# EasyEDA Pro project MIPI-toBTB-40-pin-AMOLED-HAT.eprj

# Schematic 5.5" OLED to RP5 MIPI HAT
Board Name: 5.5" OLED to RP5 MIPI HAT; Create Date: 2026-02-24; Page Name: Sheet_V3; Project Name: MIPI-toBTB-40-pin-AMOLED-HAT; Schematic Name: 5.5" OLED to RP5 MIPI HAT; Update Date: 2026-03-05; Add into BOM: yes; Convert to PCB: yes; Date: 2025-08-22; Draw By: Hjalte Hansen; REV: 3.0; Sheet: 1/1; spicePre: .
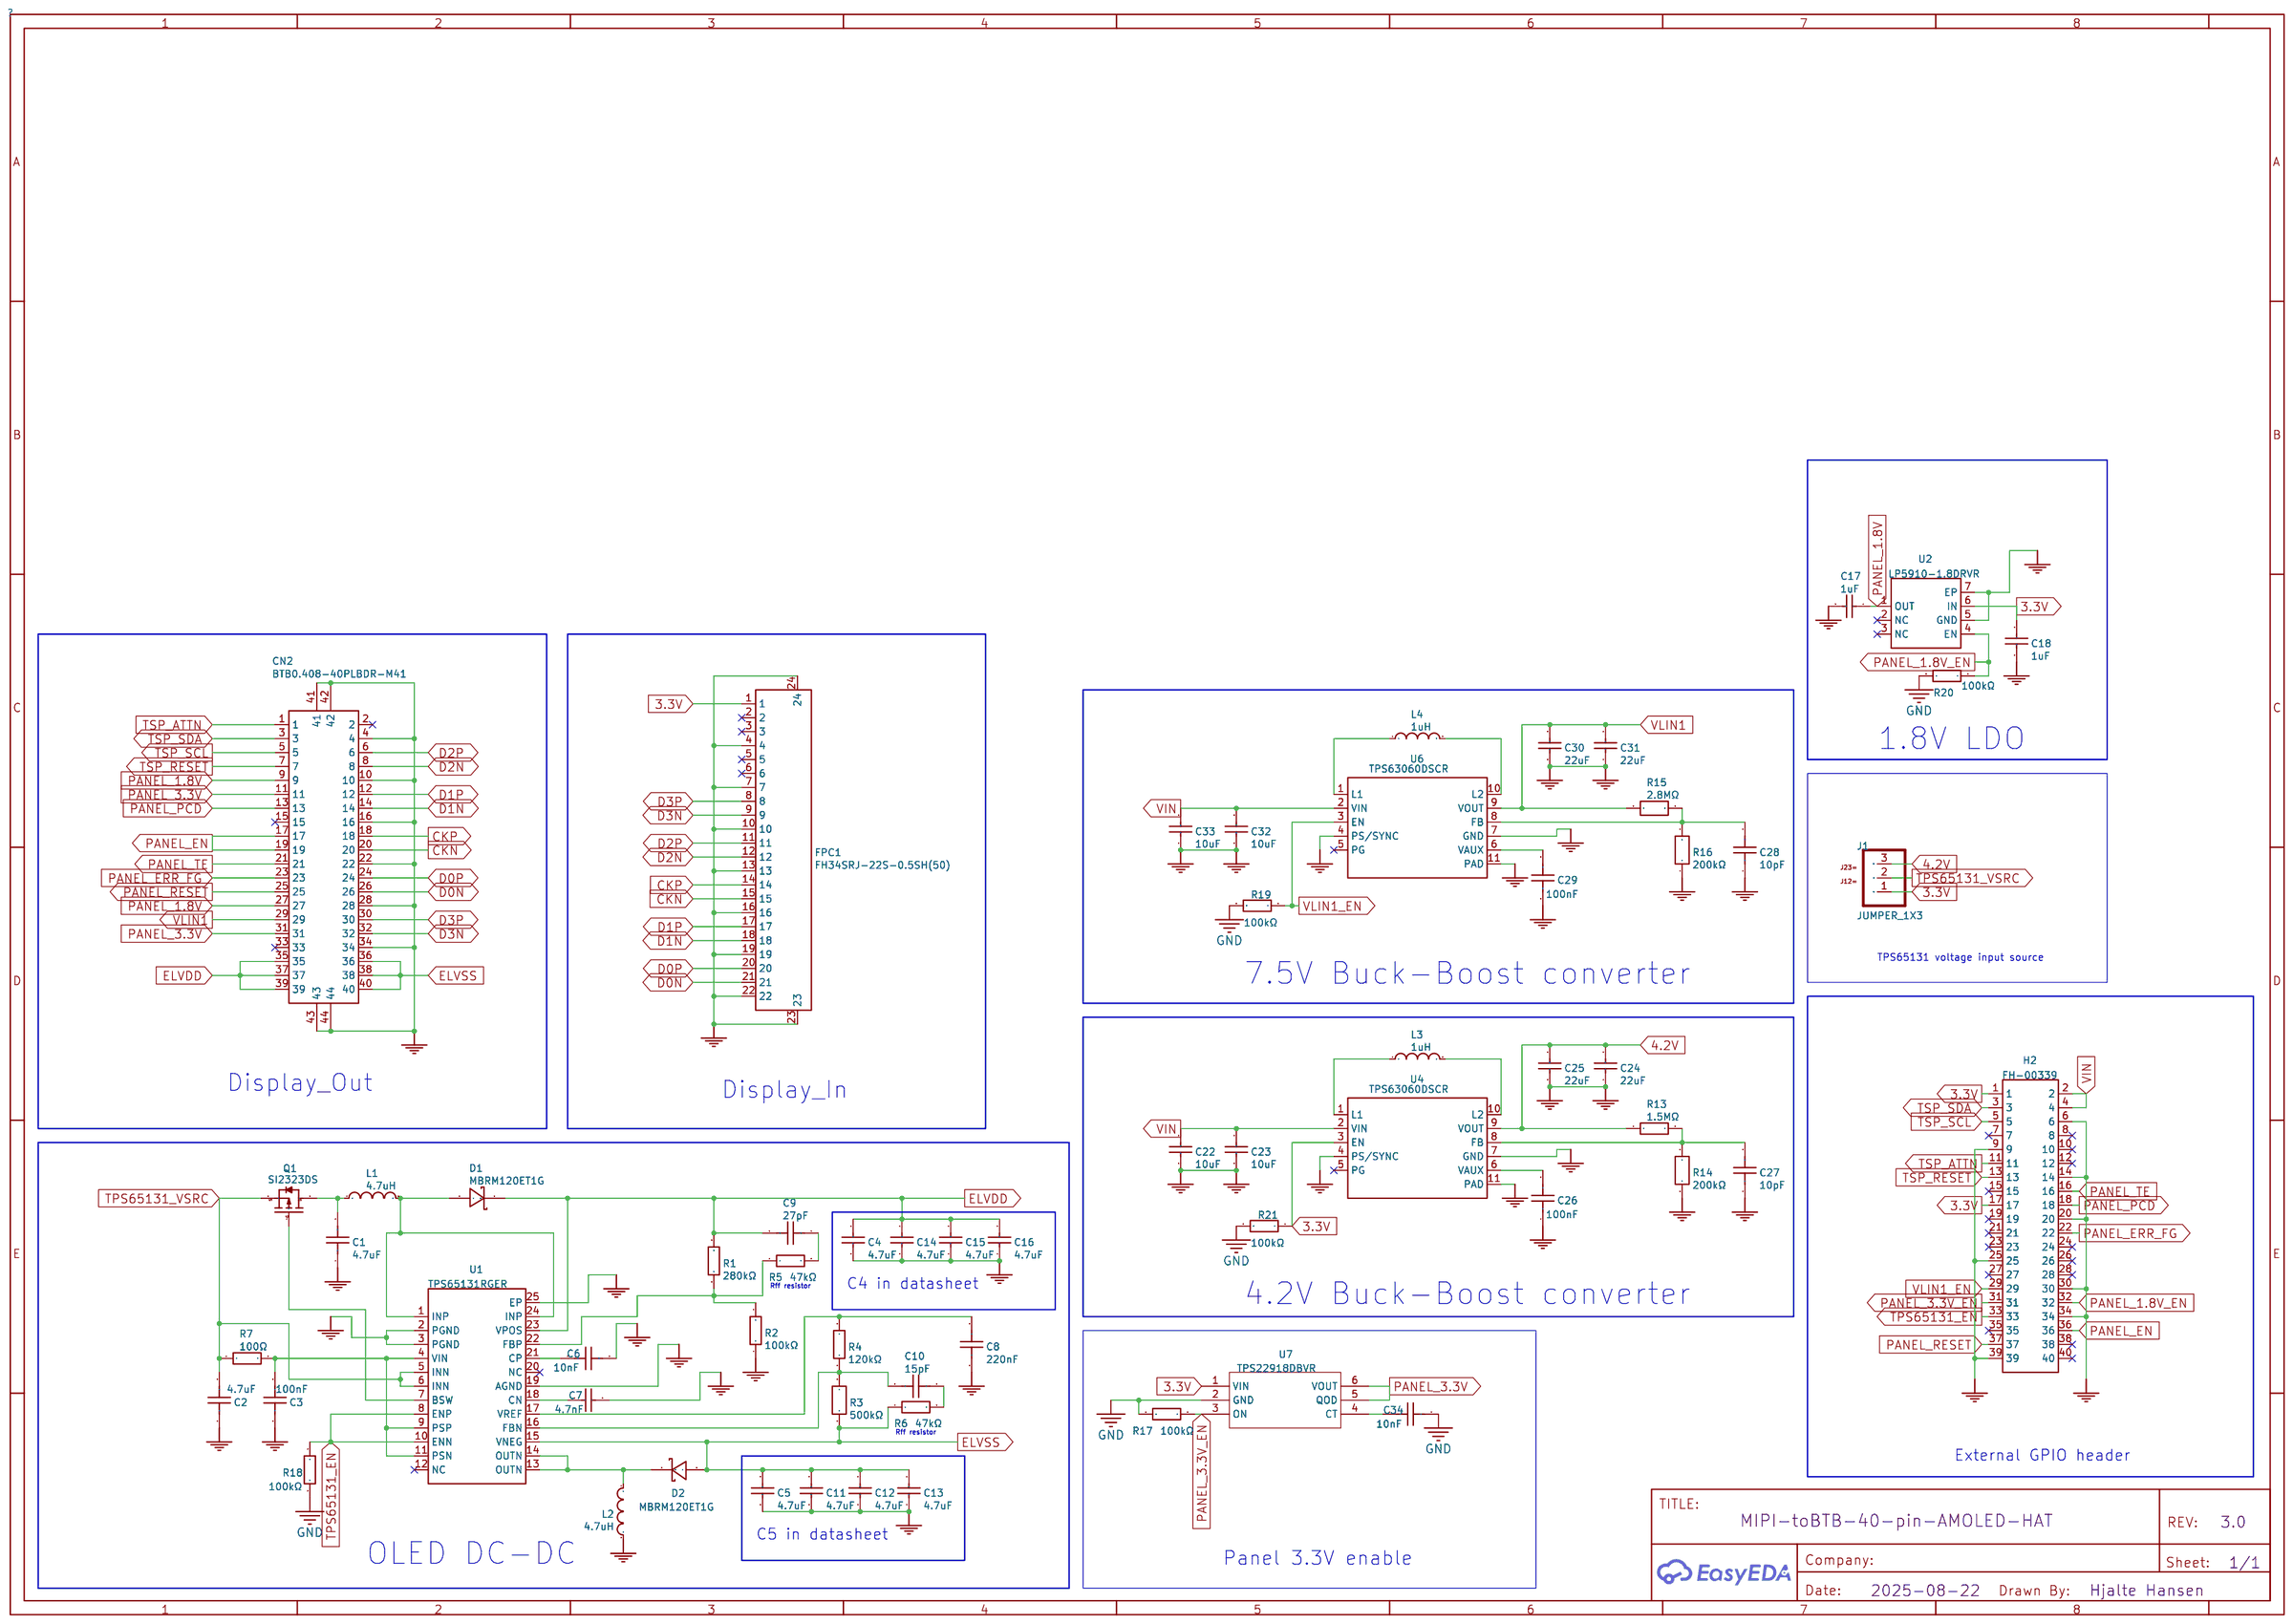
[diagram p0: schematic sheet]

## Parts
C1  4.7uF  [C0402]
C2  4.7uF  [C0402]
C3  100nF  [C0402]
C4  4.7uF  [C0805]
C5  4.7uF  [C0805]
C6  10nF  [C0402]
C7  4.7nF  [C0603]
C8  220nF  [C0402]
C9  27pF  [C0603]
C10  15pF  [C0402]
C11  4.7uF  [C0805]
C12  4.7uF  [C0805]
C13  4.7uF  [C0805]
C14  4.7uF  [C0805]
C15  4.7uF  [C0805]
C16  4.7uF  [C0805]
C17  1uF  [C0603]
C18  1uF  [C0603]
C22  10uF  [C0805]
C23  10uF  [C0805]
C24  22uF  [C0805]
C25  22uF  [C0805]
C26  100nF  [C0402]
C27  10pF  [C0402]
C28  10pF  [C0402]
C29  100nF  [C0402]
C30  22uF  [C0805]
C31  22uF  [C0805]
C32  10uF  [C0805]
C33  10uF  [C0805]
C34  10nF  [C0402]
CN2  BTB0.408-40PLBDR-M41  [CONN-SMD_40P-BTB0.408-40PLBDR-M41]
D1  MBRM120ET1G  [POWERMITE_L2.0-W1.9-LS3.8-RD]
D2  MBRM120ET1G  [POWERMITE_L2.0-W1.9-LS3.8-RD]
FPC1  FH34SRJ-22S-0.5SH(50)  [FFC-SMD_22P-P0.50_HRS_FH34SRJ-22S-0.5SH]
H2  FH-00339  [HDR-SMD_40P-P2.54-V-F-R2-C20-S6.6_FH-00339]
J1  JUMPER_1X3  [JUMPER_SOLDER]
L1  4.7uH  [IND-SMD_L4.0-W4.0_FNR40XXS]
L2  4.7uH  [IND-SMD_L4.0-W4.0_FNR40XXS]
L3  1uH  [IND-SMD_L4.5-W4.1_GSSM0420]
L4  1uH  [IND-SMD_L4.5-W4.1_GSSM0420]
Q1  SI2323DS  [SOT-23-3_L2.9-W1.3-P1.90-LS2.4-BR]
R1  280kΩ  [R0603]
R2  100kΩ  [R0603]
R3  500kΩ  [R0603]
R4  120kΩ  [R0603]
R5  47kΩ  [R0603]
R6  47kΩ  [R0603]
R7  100Ω  [R0402]
R13  1.5MΩ  [R0603]
R14  200kΩ  [R0805]
R15  2.8MΩ  [R0603]
R16  200kΩ  [R0805]
R17  100kΩ  [R0603]
R18  100kΩ  [R0603]
R19  100kΩ  [R0603]
R20  100kΩ  [R0603]
R21  100kΩ  [R0603]
U1  TPS65131RGER  [QFN-24_L4.0-W4.0-P0.50-TL-EP2.6]
U2  LP5910-1.8DRVR  [WSON-6_L2.0-W2.0-P0.65-TL-EP]
U4  TPS63060DSCR  [WSON-10_L3.0-W3.0-P0.50-BL-EP-A]
U6  TPS63060DSCR  [WSON-10_L3.0-W3.0-P0.50-BL-EP-A]
U7  TPS22918DBVR  [SOT-23-6_L2.9-W1.6-P0.95-LS2.8-BR]

## Library data of the parts
C1 C2 = 4.7uF: Supplier: LCSC; Supplier Part: C307423; Manufacturer: SAMSUNG(三星); Manufacturer Part: CL05A475MQ5NRNC; JLCPCB Part Class: Extended Part; nameAlias: Value; Contributor: LCSC; spicePre: C; spiceSymbolName: CL05A475MQ5NRNC_C307423; Package Display: No
C3 C26 C29 = 100nF: Supplier: LCSC; Supplier Part: C133086; Manufacturer: SAMSUNG(三星); Manufacturer Part: CL05B104KP5NNNC; JLCPCB Part Class: Extended Part; nameAlias: Value; Contributor: LCSC; spicePre: C; spiceSymbolName: CL05B104KP5NNNC; Package Display: No
C4 C5 C11-C13 = 4.7uF: Supplier: LCSC; Manufacturer Part: CL21A475KAQNNNE; Manufacturer: SAMSUNG(三星); Supplier Part: C1779; JLCPCB Part Class: Basic Part; nameAlias: Value; spicePre: C; spiceSymbolName: CL21A475KAQNNNE
C6 C34 = 10nF: Supplier: LCSC; Supplier Part: C318577; Manufacturer: SAMSUNG(三星); Manufacturer Part: CL05B103KO5NNNC; JLCPCB Part Class: Extended Part; nameAlias: Value; Contributor: LCSC; spicePre: C; spiceSymbolName: CL05B103KO5NNNC; Package Display: No
C7 = 4.7nF: Supplier: LCSC; Manufacturer Part: CL10B472KB8NNNC; Manufacturer: SAMSUNG(三星); Supplier Part: C1621; JLCPCB Part Class: Extended Part; nameAlias: Value; spicePre: C; spiceSymbolName: CL10B472KB8NNNC; Package Display: No
C8 = 220nF: Supplier: LCSC; Supplier Part: C307417; Manufacturer: SAMSUNG(三星); Manufacturer Part: CL05A224KQ5NNNC; JLCPCB Part Class: Extended Part; nameAlias: Value; Contributor: LCSC; spicePre: C; spiceSymbolName: CL05A224KQ5NNNC; Package Display: No
C9 = 27pF: Supplier: LCSC; Supplier Part: C2187529; Manufacturer: YAGEO(国巨); Manufacturer Part: CC0603JRNPO7BN270; JLCPCB Part Class: Extended Part; nameAlias: Value; Contributor: lcsc; spicePre: C; spiceSymbolName: CC0603JRNPO7BN270; Package Display: No
C10 = 15pF: Supplier: LCSC; Supplier Part: C1852854; Manufacturer: YAGEO(国巨); Manufacturer Part: CC0402KRNPO7BN150; JLCPCB Part Class: Extended Part; nameAlias: Value; Contributor: lcsc; spicePre: C; spiceSymbolName: CC0402KRNPO7BN150; Package Display: No
C14-C16 = 4.7uF: Supplier: LCSC; Manufacturer Part: CL21A475KAQNNNE; Manufacturer: SAMSUNG(三星); Supplier Part: C1779; JLCPCB Part Class: Basic Part; nameAlias: Value; spicePre: C; spiceSymbolName: CL21A475KAQNNNE; Package Display: No
C17 C18 = 1uF: Supplier: LCSC; Manufacturer Part: CL10A105KO8NNNC; Manufacturer: SAMSUNG(三星); Supplier Part: C1592; JLCPCB Part Class: Extended Part; nameAlias: Value; spicePre: C; spiceSymbolName: CL10A105KO8NNNC
C22 C23 C32 C33 = 10uF: Supplier: LCSC; Manufacturer Part: CL21A106KOQNNNE; Manufacturer: SAMSUNG(三星); Supplier Part: C1713; JLCPCB Part Class: Extended Part; nameAlias: Value; spicePre: C; spiceSymbolName: CL21A106KOQNNNE
C24 C25 C30 C31 = 22uF: Supplier: LCSC; Manufacturer: SAMSUNG(三星); Manufacturer Part: CL21A226MOQNNNE; Supplier Part: C98190; JLCPCB Part Class: Extended Part; nameAlias: Value; spicePre: C; spiceSymbolName: CL21A226MOQNNNE
C27 C28 = 10pF: Supplier: LCSC; Manufacturer: SAMSUNG(三星); Manufacturer Part: CL05C100JB5NNNC; Supplier Part: C32949; JLCPCB Part Class: Basic Part; nameAlias: Value; spicePre: C; spiceSymbolName: CL05C100JB5NNNC
CN2 = BTB0.408-40PLBDR-M41: Supplier: LCSC; Supplier Part: C42420583; Manufacturer: XUNPU(讯普); Contributor: lcsc; spicePre: C
D1 D2 = MBRM120ET1G: Supplier Part: C152484; Supplier: LCSC; Manufacturer: onsemi(安森美); JLCPCB Part Class: Extended Part; Contributor: LCSC; spicePre: D
FPC1 = FH34SRJ-22S-0.5SH(50): Supplier: LCSC; Supplier Part: C2889325; Manufacturer: HRS(广濑); JLCPCB Part Class: Extended Part; Contributor: LCSC; spicePre: F
H2 = FH-00339: Supplier: LCSC; Supplier Part: C2685112; Manufacturer: Liansheng(连盛); JLCPCB Part Class: Extended Part; Contributor: LCSC; spicePre: H
J1 = JUMPER_1X3
L1 L2 = 4.7uH: Supplier: LCSC; Manufacturer: cjiang(长江微电); Manufacturer Part: FNR4020S4R7MT; Supplier Part: C167828; JLCPCB Part Class: Extended Part; nameAlias: Value; Contributor: LCSC; spicePre: L; spiceSymbolName: FNR4020S4R7MT
L3 L4 = 1uH: Supplier: LCSC; Supplier Part: C2847468; Manufacturer: KOHERelec(科或); Manufacturer Part: MDA4020-1R0M; JLCPCB Part Class: Extended Part; nameAlias: Value; Contributor: lcsc; spicePre: L; spiceSymbolName: MDA4020-1R0M
Q1 = SI2323DS: Supplier: LCSC; Supplier Part: C5182044; Manufacturer: TECH PUBLIC(台舟); JLCPCB Part Class: Extended Part; Contributor: lcsc; spicePre: Q
R1 = 280kΩ: Supplier: LCSC; Manufacturer: UNI-ROYAL(厚声); Manufacturer Part: 0603WAF2803T5E; Supplier Part: C22970; JLCPCB Part Class: Extended Part; nameAlias: Value; spicePre: R; spiceSymbolName: 0603WAF2803T5E
R2 R17-R21 = 100kΩ: Supplier: LCSC; Manufacturer: UNI-ROYAL(厚声); Manufacturer Part: 0603WAF1003T5E; Supplier Part: C25803; JLCPCB Part Class: Basic Part; nameAlias: Value; spicePre: R; spiceSymbolName: 0603WAF1003T5E
R3 = 500kΩ: Supplier: LCSC; Supplier Part: C2902631; Manufacturer: Viking(光颉); Manufacturer Part: AR03BTCX5003N; JLCPCB Part Class: Extended Part; nameAlias: Value; Contributor: LCSC; spicePre: R; spiceSymbolName: AR03BTCX5003N
R4 = 120kΩ: Supplier: LCSC; Manufacturer: UNI-ROYAL(厚声); Manufacturer Part: 0603WAF1203T5E; Supplier Part: C25808; JLCPCB Part Class: Basic Part; nameAlias: Value; spicePre: R; spiceSymbolName: 0603WAF1203T5E
R5 R6 = 47kΩ: Supplier: LCSC; Manufacturer: YAGEO(国巨); Manufacturer Part: RC0603FR-0747KL; Supplier Part: C105579; JLCPCB Part Class: Extended Part; nameAlias: Value; spicePre: R; spiceSymbolName: RC0603FR-0747KL
R7 = 100Ω: Supplier: LCSC; Manufacturer: YAGEO(国巨); Manufacturer Part: RC0402FR-07100RL; Supplier Part: C106232; JLCPCB Part Class: Extended Part; nameAlias: Value; spicePre: R; spiceSymbolName: RC0402FR-07100RL; Package Display: No
R13 = 1.5MΩ: Supplier: LCSC; Manufacturer: YAGEO(国巨); Manufacturer Part: RC0603FR-071M5L; Supplier Part: C137773; JLCPCB Part Class: Extended Part; nameAlias: Value; spicePre: R; spiceSymbolName: RC0603FR-071M5L
R14 R16 = 200kΩ: Supplier: LCSC; Supplier Part: C2907238; Manufacturer: FOJAN(富捷); Manufacturer Part: FRC0805F2003TS; JLCPCB Part Class: Extended Part; nameAlias: Value; Contributor: lcsc; spicePre: R; spiceSymbolName: FRC0805F2003TS
R15 = 2.8MΩ: Supplier: LCSC; Supplier Part: C482811; Manufacturer: YAGEO(国巨); Manufacturer Part: RC0603FR-072M8L; JLCPCB Part Class: Extended Part; Contributor: LCSC; nameAlias: Value; spicePre: R; spiceSymbolName: RC0603FR-072M8L
U1 = TPS65131RGER: Supplier: LCSC; Manufacturer: TI(德州仪器); Supplier Part: C87663; JLCPCB Part Class: Extended Part; spicePre: U
U2 = LP5910-1.8DRVR: Supplier: LCSC; Supplier Part: C2867568; Manufacturer: TI(德州仪器); JLCPCB Part Class: Extended Part; Contributor: LCSC; spicePre: U
U4 U6 = TPS63060DSCR: Supplier: LCSC; Manufacturer: TI(德州仪器); Supplier Part: C48567; JLCPCB Part Class: Extended Part; spicePre: U
U7 = TPS22918DBVR: LCSC Part Name: 5.5V 2A 导通电阻为52mΩ的负载开关; Supplier Part: C131941; Manufacturer: TI(德州仪器); Supplier Footprint: SOT-23-6; JLCPCB Part Class: Extended Part; Datasheet: https://www.ti.com/cn/lit/gpn/tps22918; Supplier: LCSC; Type: Load Switch; Number of Channels: 1; Control Input Logic: Active High; Maximum Continuous Current: 2A; Voltage - Supply: 1V~5.5V; RDS(on): 53mΩ; Operating Temperature	-: -40℃~+105℃

## Nets
3.3V: C18.1 FPC1.1 H2.1 H2.17 J1.1(VCC) R21.1 U2.6(IN) U4.3(EN) U7.1(VIN)
4.2V: C24.2 C25.2 J1.3(GND) R13.1 U4.9(VOUT)
GND: C1.1 C2.1 C3.1 C4.1 C5.1 C6.2 C7.2 C8.1 C11.1 C12.1 C13.1 C14.1 C15.1 C16.1 C17.2 C18.2 C22.1 C23.1 C24.1 C25.1 C26.1 C27.1 C28.1 C29.1 C30.1 C31.1 C32.1 C33.1 C34.2 CN2.4 CN2.10 CN2.16 CN2.22 CN2.28 CN2.34 CN2.41 CN2.42 CN2.43 CN2.44 FPC1.4 FPC1.7 FPC1.10 FPC1.13 FPC1.16 FPC1.19 FPC1.22 FPC1.23 FPC1.24 H2.6 H2.9 H2.14 H2.20 H2.25 H2.30 H2.34 H2.39 L2.2 R2.1 R14.1 R16.1 R17.2 R18.2 R19.2 R20.2 R21.2 U1.2(PGND) U1.3(PGND) U1.19(AGND) U1.25(EP) U2.5(GND) U2.7(EP) U4.4(PS/SYNC) U4.7(GND) U4.11(PAD) U6.4(PS/SYNC) U6.7(GND) U6.11(PAD) U7.2(GND)
VIN: C22.2 C23.2 C32.2 C33.2 H2.2 H2.4 U4.2(VIN) U6.2(VIN)
CKN: CN2.20 FPC1.15
CKP: CN2.18 FPC1.14
D0N: CN2.26 FPC1.21
D0P: CN2.24 FPC1.20
D1N: CN2.14 FPC1.18
D1P: CN2.12 FPC1.17
D2N: CN2.8 FPC1.12
D2P: CN2.6 FPC1.11
D3N: CN2.32 FPC1.9
D3P: CN2.30 FPC1.8
ELVDD: C4.2 C9.2 C14.2 C15.2 C16.2 CN2.35 CN2.37 CN2.39 D1.1(C) R1.2 U1.23(VPOS)
ELVSS: C5.2 C11.2 C12.2 C13.2 CN2.36 CN2.38 CN2.40 D2.2(A) R3.1 R6.1 U1.15(VNEG)
PANEL_1.8V: C17.1 CN2.9 CN2.27 U2.1(OUT)
PANEL_1.8V_EN: H2.32 R20.1 U2.4(EN)
PANEL_3.3V: CN2.11 CN2.31 U7.5(QOD) U7.6(VOUT)
PANEL_3.3V_EN: H2.31 R17.1 U7.3(ON)
PANEL_EN: CN2.17 CN2.19 H2.36
PANEL_ERR_FG: CN2.23 H2.22
PANEL_PCD: CN2.13 H2.18
PANEL_RESET: CN2.25 H2.37
PANEL_TE: CN2.21 H2.16
TPS65131_EN: H2.33 R18.1 U1.8(ENP) U1.10(ENN)
TPS65131_VSRC: C2.2 J1.2(I/O) Q1.2(S) R7.1 U1.5(INN) U1.6(INN)
TSP_ATTN: CN2.1 H2.11
TSP_RESET: CN2.7 H2.13
TSP_SCL: CN2.5 H2.5
TSP_SDA: CN2.3 H2.3
VLIN1: C30.2 C31.2 CN2.29 R15.1 U6.9(VOUT)
VLIN1_EN: H2.29 R19.1 U6.3(EN)
$1N52: D2.1(C) L2.1 U1.13(OUTN) U1.14(OUTN)
$1N56: D1.2(A) L1.2 U1.1(INP) U1.24(INP)
$1N59: C7.1 U1.18(CN)
$1N60: C6.1 U1.21(CP)
$1N63: C1.2 L1.1 Q1.3(D)
$1N65: Q1.1(G) U1.7(BSW)
$1N66: C8.2 R4.2 U1.17(VREF)
$1N67: C10.2 R3.2 R4.1 U1.16(FBN)
$1N68: R1.1 R2.2 R5.1 U1.22(FBP)
$1N73: C10.1 R6.2
$1N74: C9.1 R5.2
$1N95: C3.2 R7.2 U1.4(VIN) U1.9(PSP) U1.11(PSN)
$1N117: L3.2 U4.10(L2)
$1N118: L3.1 U4.1(L1)
$1N123: C26.2 U4.6(VAUX)
$1N127: C27.2 R13.2 R14.2 U4.8(FB)
$1N132: C28.2 R15.2 R16.2 U6.8(FB)
$1N137: C29.2 U6.6(VAUX)
$1N140: L4.1 U6.1(L1)
$1N141: L4.2 U6.10(L2)
$1N6505: C34.1 U7.4(CT)

Not connected (* = marked no-connect by the designer): CN2 2* 15* 33*; FPC1 2* 3* 5* 6*; H2 7* 8* 10* 12* 15* 19* 21* 23* 24* 26* 27* 28* 35* 38* 40*; U1 12(NC)* 20(NC)*; U2 2(NC)* 3(NC)*; U4 5(PG)*; U6 5(PG)*

## Notes on the sheet
- 1.8V LDO
- TPS65131 voltage input source
- 7.5V Buck-Boost converter
- Display_Out
- Display_In
- Rff resistor
- C4 in datasheet
- 4.2V Buck-Boost converter
- Rff resistor
- External GPIO header
- C5 in datasheet
- OLED DC-DC
- Panel 3.3V enable

# Board 1-PCB_PCB_5.5" OLED to RP5 MIPI
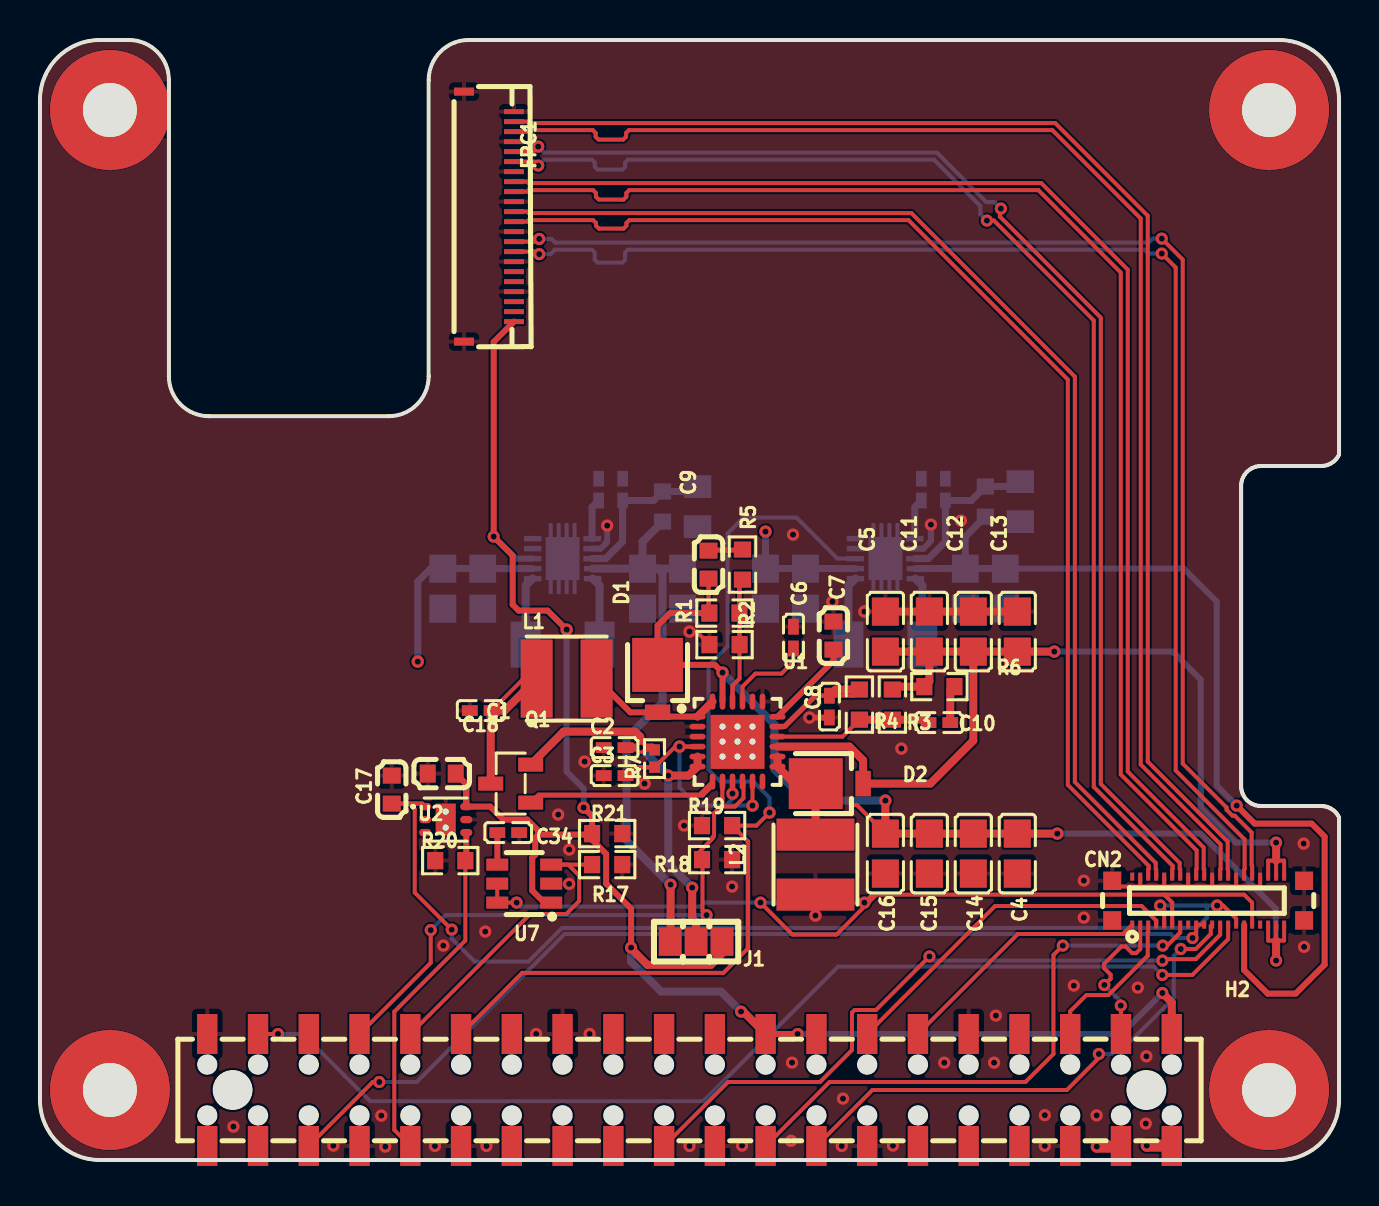
[diagram p1: board, top side]
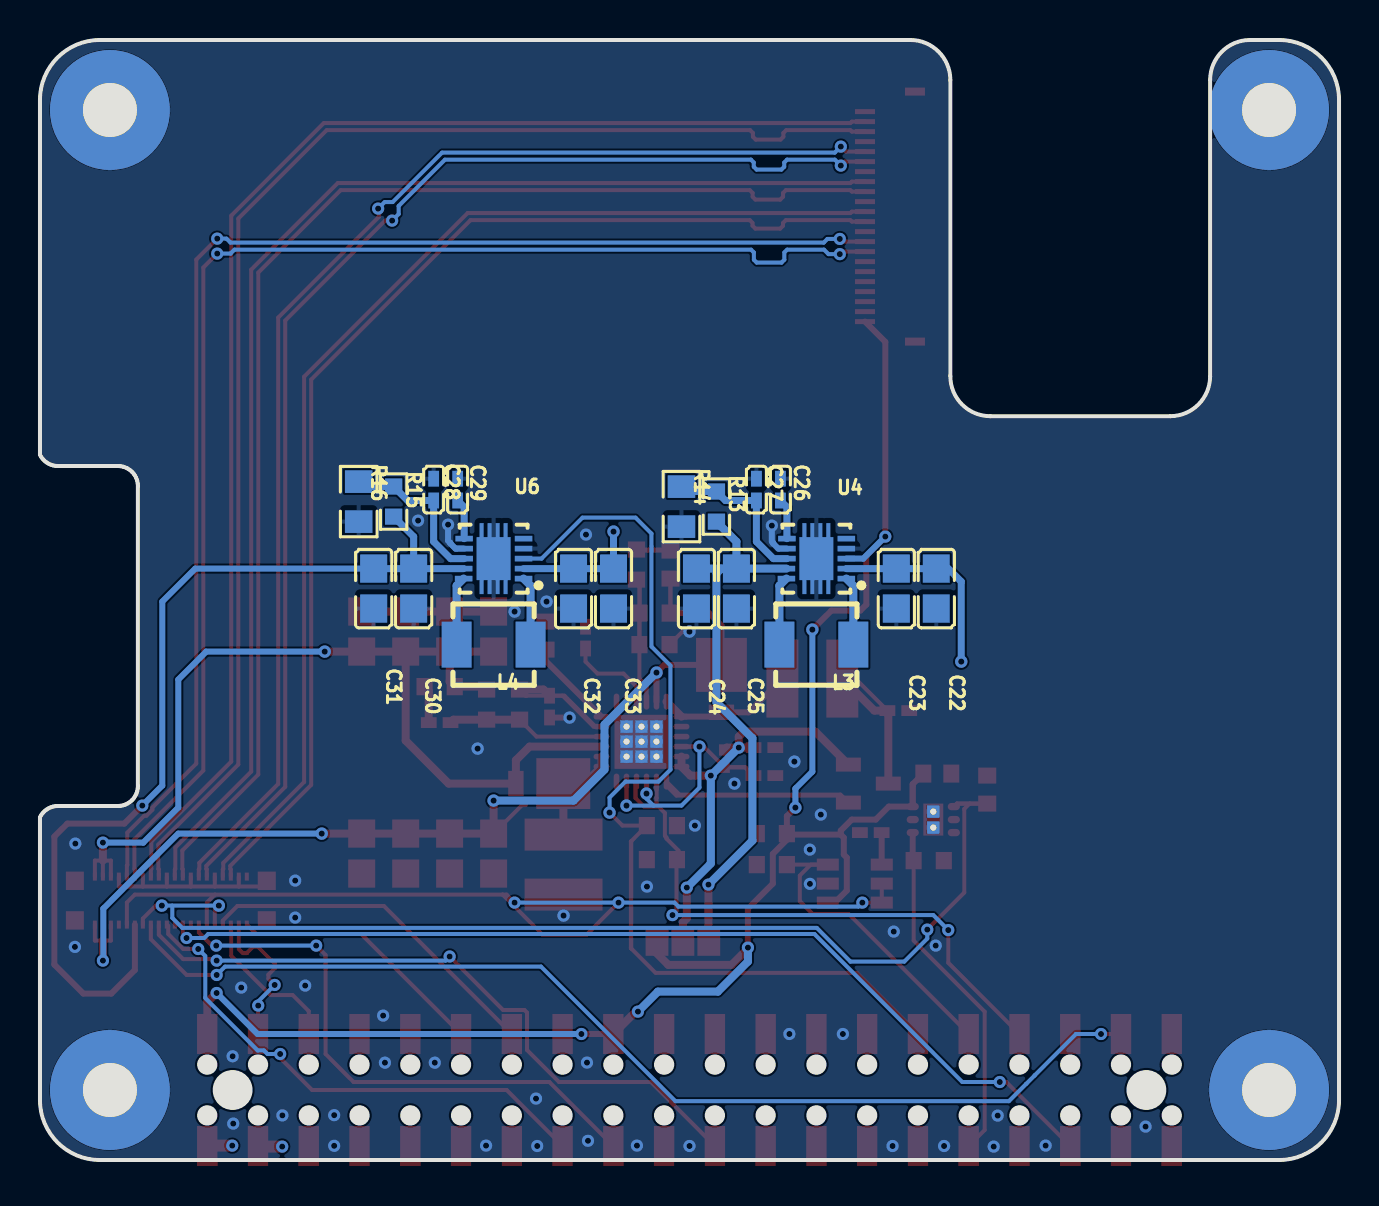
[diagram p2: board, bottom side, seen from below]

Outline 65 x 56 mm; copper layers: Top Layer, VIN, GND, Bottom Layer. Coordinates in mm from the lower left corner of the outline.
Outline path: 0,53 0,3 arc(0.88,0.88) 3,0 62,0 arc(64.12,0.88) 65,3 65,17.14 64.94,17.24 64.87,17.34 64.79,17.43 64.69,17.51 64.58,17.58 64.47,17.63 64.35,17.67 64.23,17.69 64.1,17.7 61.1,17.7 60.98,17.71 60.85,17.73 60.73,17.77 60.62,17.82 60.51,17.89 60.42,17.97 60.37,18.02 60.29,18.11 60.22,18.22 60.17,18.33 60.13,18.45 60.11,18.58 60.1,18.7 60.1,33.7 60.11,33.83 60.13,33.95 60.15,34.01 60.2,34.13 60.26,34.24 60.29,34.29 60.37,34.39 60.42,34.43 60.51,34.51 60.62,34.58 60.67,34.61 60.79,34.65 60.85,34.67 60.98,34.69 61.1,34.7 64.1,34.7 64.23,34.71 64.35,34.73 64.47,34.77 64.58,34.82 64.69,34.89 64.79,34.97 64.87,35.06 64.94,35.16 65,35.26 65,53 arc(64.12,55.12) 62,56 21.45,56 arc(20.04,55.41) 19.45,54 19.45,39.19 arc(18.86,37.78) 17.45,37.19 8.45,37.19 arc(7.04,37.78) 6.45,39.19 6.45,54 arc(5.86,55.41) 4.45,56 3,56 arc(0.88,55.12) 0,53
Stack: Top Layer 0.035mm / Dielectric1 0.48mm PP er 4.5 / VIN 0.035mm / Dielectric2 0.48mm FR4 er 4.5 / GND 0.035mm / Dielectric3 0.48mm PP er 4.5 / Bottom Layer 0.035mm

## Design rules (mm)
net CKP: DP1
net CKN: DP1
net D0P: DP2
net D1P: DP4
net D1N: DP4
net D2P: DP5
net D2N: DP5
net D3P: DP3
net D3N: DP3
net D0N: DP2
net TSP_SDA: DP6
net TSP_SCL: DP6
spacing Default (default): track to track 0.1, other pairs 0 to 0.1
track width Default (default): min 0.2, default 0.2, max 25.4
differential pair differentialPair (default): width min 0.127, default 0.254, max 2.54; gap min 0.152, default 0.152
via Default (default): diameter min 0.61, default 0.61, max 100.025; hole min 0.305, default 0.305, max 59.995

## Placement (name value [footprint] x y rotation side)
C1  4.7uF  [C0402]  22.05 22.47 0 top
C2  4.7uF  [C0402]  28.75 20.62 0 top
C3  100nF  [C0402]  28.75 19.22 0 top
C4  4.7uF  [C0805]  48.9 15.32 90 top
C5  4.7uF  [C0805]  42.3 26.42 270 top
C6  10nF  [C0402]  37.7 26.12 90 top
C7  4.7nF  [C0603]  39.7 26.22 90 top
C8  220nF  [C0402]  39.5 22.67 90 top
C9  27pF  [C0603]  33.45 29.77 270 top
C10  15pF  [C0402]  45 21.87 180 top
C11  4.7uF  [C0805]  44.5 26.42 270 top
C12  4.7uF  [C0805]  46.7 26.42 270 top
C13  4.7uF  [C0805]  48.9 26.42 270 top
C14  4.7uF  [C0805]  46.7 15.32 90 top
C15  4.7uF  [C0805]  44.5 15.32 90 top
C16  4.7uF  [C0805]  42.3 15.32 90 top
C17  1uF  [C0603]  17.6 18.52 90 top
C18  1uF  [C0603]  20.1 19.32 180 top
C22  10uF  [C0805]  20.15 28.57 90 bottom
C23  10uF  [C0805]  22.15 28.57 90 bottom
C24  22uF  [C0805]  32.15 28.57 90 bottom
C25  22uF  [C0805]  30.15 28.57 90 bottom
C26  100nF  [C0402]  27.95 33.52 270 bottom
C27  10pF  [C0402]  29.15 33.52 270 bottom
C28  10pF  [C0402]  45.3 33.52 270 bottom
C29  100nF  [C0402]  44.1 33.52 270 bottom
C30  22uF  [C0805]  46.3 28.57 90 bottom
C31  22uF  [C0805]  48.3 28.57 90 bottom
C32  10uF  [C0805]  38.3 28.57 90 bottom
C33  10uF  [C0805]  36.3 28.57 90 bottom
C34  10nF  [C0402]  23.43 16.37 0 top
CN2  BTB0.408-40PLBDR-M41  [CONN-SMD_40P-BTB0.408-40PLBDR-M41]  58.45 12.97 0 top
D1  MBRM120ET1G  [POWERMITE_L2.0-W1.9-LS3.8-RD]  30.9 23.57 270 top
D2  MBRM120ET1G  [POWERMITE_L2.0-W1.9-LS3.8-RD]  40 18.82 0 top
FPC1  FH34SRJ-22S-0.5SH(50)  [FFC-SMD_22P-P0.50_HRS_FH34SRJ-22S-0.5SH]  22.47 47.17 270 top
H2  FH-00339  [HDR-SMD_40P-P2.54-V-F-R2-C20-S6.6_FH-00339]  32.5 3.5 180 top
J1  JUMPER_1X3  [JUMPER_SOLDER]  32.83 10.92 180 top
L1  4.7uH  [IND-SMD_L4.0-W4.0_FNR40XXS]  26.35 24.07 0 top
L2  4.7uH  [IND-SMD_L4.0-W4.0_FNR40XXS]  38.8 14.77 270 top
L3  1uH  [IND-SMD_L4.5-W4.1_GSSM0420]  26.15 25.77 0 bottom
L4  1uH  [IND-SMD_L4.5-W4.1_GSSM0420]  42.3 25.77 0 bottom
NOREF  -  [Pad_e1300]  34.9 21.67 180 top
NOREF#2  -  [Pad_e1299]  35.65 21.67 180 top
NOREF#3  -  [Pad_e1330]  20.3 17.42 180 top
NOREF#4  -  [Pad_e1305]  35.65 20.17 180 top
NOREF#5  -  [Pad_e1311]  3.5 3.5 0 top
NOREF#6  -  [Pad_e1307]  34.15 20.17 180 top
NOREF#7  -  [Pad_e1310]  61.5 3.5 0 top
NOREF#8  -  [Pad_e1304]  35.65 20.92 180 top
NOREF#9  -  [Pad_e1301]  34.15 21.67 180 top
NOREF#10  -  [Pad_e1302]  34.15 20.92 180 top
NOREF#11  -  [Pad_e1331]  20.3 16.62 180 top
NOREF#12  -  [Pad_e1312]  3.5 52.5 0 top
NOREF#13  -  [Pad_e1303]  34.9 20.92 180 top
NOREF#14  -  [Pad_e1309]  61.5 52.5 0 top
NOREF#15  -  [Pad_e1306]  34.9 20.17 180 top
Q1  SI2323DS  [SOT-23-3_L2.9-W1.3-P1.90-LS2.4-BR]  23.55 18.82 0 top
R1  280kΩ  [R0603]  34.25 27.34 180 top
R2  100kΩ  [R0603]  34.25 25.77 0 top
R3  500kΩ  [R0603]  42.65 22.77 270 top
R4  120kΩ  [R0603]  41 22.77 90 top
R5  47kΩ  [R0603]  35.15 29.77 90 top
R6  47kΩ  [R0603]  45 23.67 0 top
R7  100Ω  [R0402]  30.75 20.07 270 top
R13  1.5MΩ  [R0603]  31.15 32.67 90 bottom
R14  200kΩ  [R0805]  32.9 32.67 90 bottom
R15  2.8MΩ  [R0603]  47.3 32.92 90 bottom
R16  200kΩ  [R0805]  49.05 32.92 90 bottom
R17  100kΩ  [R0603]  28.38 14.77 0 top
R18  100kΩ  [R0603]  33.88 15.02 0 top
R19  100kΩ  [R0603]  33.88 16.72 180 top
R20  100kΩ  [R0603]  20.53 14.97 180 top
R21  100kΩ  [R0603]  28.38 16.32 0 top
U1  TPS65131RGER  [QFN-24_L4.0-W4.0-P0.50-TL-EP2.6]  34.9 20.92 0 top
U2  LP5910-1.8DRVR  [WSON-6_L2.0-W2.0-P0.65-TL-EP]  20.3 17.02 0 top
U4  TPS63060DSCR  [WSON-10_L3.0-W3.0-P0.50-BL-EP-A]  26.15 30.07 90 bottom
U6  TPS63060DSCR  [WSON-10_L3.0-W3.0-P0.50-BL-EP-A]  42.3 30.07 90 bottom
U7  TPS22918DBVR  [SOT-23-6_L2.9-W1.6-P0.95-LS2.8-BR]  24.23 13.82 0 top

## Footprints (pads in the part's own frame, mm; a bottom-side part is the same pattern mirrored in y, then rotated)
C0402
  rect 0.79x0.54 smd: 1(-0.545,0) 2(0.545,0)
C0603
  rect 0.8x0.9 smd: 1(-0.7,0) 2(0.7,0)
C0805
  rect 1.41x1.35 smd: 1(-1,0) 2(1,0)
CONN-SMD_40P-BTB0.408-40PLBDR-M41
  rect 0.2x0.4 smd: 1(-3.8,-1.2) 2(-3.8,1.2) 3(-3.4,-1.2) 4(-3.4,1.2) 5(-3,-1.2) 6(-3,1.2) 7(-2.6,-1.2) 8(-2.6,1.2) 9(-2.2,-1.2) 10(-2.2,1.2) 11(-1.8,-1.2) 12(-1.8,1.2) 13(-1.4,-1.2) 14(-1.4,1.2) 15(-1,-1.2) 16(-1,1.2) 17(-0.6,-1.2) 18(-0.6,1.2) 19(-0.2,-1.2) 20(-0.2,1.2) 21(0.2,-1.2) 22(0.2,1.2) 23(0.6,-1.2) 24(0.6,1.2) 25(1,-1.2) 26(1,1.2) 27(1.4,-1.2) 28(1.4,1.2) 29(1.8,-1.2) 30(1.8,1.2) 31(2.2,-1.2) 32(2.2,1.2) 33(2.6,-1.2) 34(2.6,1.2) 35(3,-1.2) 36(3,1.2) 37(3.4,-1.2) 38(3.4,1.2) 39(3.8,-1.2) 40(3.8,1.2)
  rect 0.9x0.92 smd: 41(-4.8,-0.99) 42(-4.8,0.99) 43(4.8,0.99) 44(4.8,-0.99)
FFC-SMD_22P-P0.50_HRS_FH34SRJ-22S-0.5SH
  rect 0.25x1 smd: 1(5.25,1.25) 2(4.75,1.25) 3(4.25,1.25) 4(3.75,1.25) 5(3.25,1.25) 6(2.75,1.25) 7(2.25,1.25) 8(1.75,1.25) 9(1.25,1.25) 10(0.75,1.25) 11(0.25,1.25) 12(-0.25,1.25) 13(-0.75,1.25) 14(-1.25,1.25) 15(-1.75,1.25) 16(-2.25,1.25) 17(-2.75,1.25) 18(-3.25,1.25) 19(-3.75,1.25) 20(-4.25,1.25) 21(-4.75,1.25) 22(-5.25,1.25)
  rect 0.4x1 smd: 23(-6.25,-1.25) 24(6.25,-1.25)
HDR-SMD_40P-P2.54-V-F-R2-C20-S6.6_FH-00339
  rect 1.02x2 smd: 1(-24.13,-2.8) 2(-24.13,2.8) 3(-21.59,-2.8) 4(-21.59,2.8) 5(-19.05,-2.8) 6(-19.05,2.8) 7(-16.51,-2.8) 8(-16.51,2.8) 9(-13.97,-2.8) 10(-13.97,2.8) 11(-11.43,-2.8) 12(-11.43,2.8) 13(-8.89,-2.8) 14(-8.89,2.8) 15(-6.35,-2.8) 16(-6.35,2.8) 17(-3.81,-2.8) 18(-3.81,2.8) 19(-1.27,-2.8) 20(-1.27,2.8) 21(1.27,-2.8) 22(1.27,2.8) 23(3.81,-2.8) 24(3.81,2.8) 25(6.35,-2.8) 26(6.35,2.8) 27(8.89,-2.8) 28(8.89,2.8) 29(11.43,-2.8) 30(11.43,2.8) 31(13.97,-2.8) 32(13.97,2.8) 33(16.51,-2.8) 34(16.51,2.8) 35(19.05,-2.8) 36(19.05,2.8) 37(21.59,-2.8) 38(21.59,2.8) 39(24.13,-2.8) 40(24.13,2.8)
IND-SMD_L4.0-W4.0_FNR40XXS
  rect 1.6x3.9 smd: 1(-1.5,0) 2(1.5,0)
IND-SMD_L4.5-W4.1_GSSM0420
  rect 1.5x2.3 smd: 1(-1.85,0) 2(1.85,0)
JUMPER_SOLDER
  rect 1.143x1.423 smd: 1(-1.296,0) 2(0,0) 3(1.296,0)
Pad_e1299
  rect 0.62x0.62 hole 0.31: (0,0)
Pad_e1300
  rect 0.62x0.62 hole 0.31: (0,0)
Pad_e1301
  rect 0.62x0.62 hole 0.31: (0,0)
Pad_e1302
  rect 0.62x0.62 hole 0.31: (0,0)
Pad_e1303
  rect 0.62x0.62 hole 0.31: (0,0)
Pad_e1304
  rect 0.62x0.62 hole 0.31: (0,0)
Pad_e1305
  rect 0.62x0.62 hole 0.31: (0,0)
Pad_e1306
  rect 0.62x0.62 hole 0.31: (0,0)
Pad_e1307
  rect 0.62x0.62 hole 0.31: (0,0)
Pad_e1309
  round 6 hole 2.7: 1(0,0)
Pad_e1310
  round 6 hole 2.7: 1(0,0)
Pad_e1311
  round 6 hole 2.7: 1(0,0)
Pad_e1312
  round 6 hole 2.7: 1(0,0)
Pad_e1330
  rect 0.62x0.62 hole 0.31: (0,0)
Pad_e1331
  rect 0.62x0.62 hole 0.31: (0,0)
POWERMITE_L2.0-W1.9-LS3.8-RD
  rect 2.7x2.54 smd: 1(-1.185,-0.001)
  rect 0.77x1.27 smd: 2(1.185,0.001)
QFN-24_L4.0-W4.0-P0.50-TL-EP2.6
  oval 0.8x0.28 smd: 1(-2,1.25) 2(-2,0.75) 3(-2,0.249) 4(-2,-0.25) 5(-2,-0.75) 6(-2,-1.25) 13(2,-1.25) 14(2,-0.75) 15(2,-0.25) 16(2,0.249) 17(2,0.75) 18(2,1.242)
  oval 0.28x0.8 smd: 7(-1.25,-2) 8(-0.75,-2) 9(-0.249,-2) 10(0.25,-2) 11(0.75,-2) 12(1.25,-2) 19(1.25,2) 20(0.75,2) 21(0.25,2) 22(-0.249,2) 23(-0.75,2) 24(-1.25,2)
  rect 2.7x2.7 smd: 25(0,-0.013)
R0402
  rect 0.566x0.54 smd: 1(-0.433,0) 2(0.432,0)
R0603
  rect 0.806x0.864 smd: 1(-0.753,0) 2(0.753,0)
R0805
  rect 1.133x1.377 smd: 1(-1,0) 2(1,0)
SOT-23-3_L2.9-W1.3-P1.90-LS2.4-BR
  rect 1.25x0.7 smd: 1(1,-0.95) 2(1,0.95) 3(-1,0)
SOT-23-6_L2.9-W1.6-P0.95-LS2.8-BR
  rect 1.1x0.6 smd: 1(1.35,-0.95) 2(1.35,0) 3(1.35,0.95) 4(-1.35,0.95) 5(-1.35,0) 6(-1.35,-0.95)
WSON-6_L2.0-W2.0-P0.65-TL-EP
  oval 0.607x0.364 smd: 1(-1.028,0.65) 2(-1.028,0) 3(-1.028,-0.65) 4(1.028,-0.65) 5(1.028,0) 6(1.028,0.65)
  rect 1x1.6 smd: 7(0,0)
WSON-10_L3.0-W3.0-P0.50-BL-EP-A
  rect 0.28x0.876 smd: 1(-1,-1.5) 2(-0.5,-1.5) 3(0,-1.5) 4(0.5,-1.5) 5(1,-1.5) 6(1,1.474) 7(0.499,1.472) 8(-0.001,1.473) 9(-0.5,1.5) 10(-1,1.5)
  custom 3.55x1.7 smd: 11(0,0)

## Nets
As in the schematic, except:
GND: C1.1 C2.1 C3.1 C4.1 C5.1 C6.2 C7.2 C8.1 C11.1 C12.1 C13.1 C14.1 C15.1 C16.1 C17.2 C18.2 C22.1 C23.1 C24.1 C25.1 C26.1 C27.1 C28.1 C29.1 C30.1 C31.1 C32.1 C33.1 C34.2 CN2.4 CN2.10 CN2.16 CN2.22 CN2.28 CN2.34 CN2.41 CN2.42 CN2.43 CN2.44 FPC1.4 FPC1.7 FPC1.10 FPC1.13 FPC1.16 FPC1.19 FPC1.22 FPC1.23 FPC1.24 H2.6 H2.9 H2.14 H2.20 H2.25 H2.30 H2.34 H2.39 L2.2 NOREF. NOREF#2. NOREF#3. NOREF#4. NOREF#5.1 NOREF#6. NOREF#7.1 NOREF#8. NOREF#9. NOREF#10. NOREF#11. NOREF#12.1 NOREF#13. NOREF#14.1 NOREF#15. R2.1 R14.1 R16.1 R17.2 R18.2 R19.2 R20.2 R21.2 U1.2 U1.3 U1.19 U1.25 U2.5 U2.7 U4.4 U4.7 U4.11 U6.4 U6.7 U6.11 U7.2

Pads without a net: CN2 2 15 33; FPC1 2 3 5 6; H2 7 8 10 12 15 19 21 23 24 26 27 28 35 38 40; U1 12 20; U2 2 3; U4 5; U6 5

## Via types
v1: diameter 0.61, hole 0.305, Top Layer to Bottom Layer, 80 vias
v2: diameter 0.62, hole 0.31, Top Layer to Bottom Layer, 31 vias

## Routing (per net, layer and track width the routed paths; a pad name or vN(x,y) marks a point on that pad's centre or on a via; arc(x,y) is an arc through that point)
3.3V: length 89.7
  Top Layer w0.3: U7.1 25.23,12.87 24.63,13.47 24.63,15.12 24.78,15.27 24.78,16.12 24.93,16.27 ; 24.93,16.27 27.58,16.27 R21.1 ; 24.93,16.27 24.93,16.47 24.38,17.02 23.18,17.02 22.53,17.67 21.33,17.67 ; v2(26.35,26.52) 25.4,27.47 23.95,27.47 23.65,27.77 23.65,30.22 v1(22.7,31.17) 22.7,40.9 23.72,41.92 ; 21.33,17.67 21.33,18.79 ; 21.33,17.67 21.33,18.79 ; 21.33,18.79 20.8,19.32 ; v1(29.58,10.62) 29.58,10.62 29.58,12.57 28.33,13.82 28.33,15.31 27.63,16.01 R21.1 ; v2(27.2,17.62) 27.63,17.2 R21.1 ; H2.17 v1(37.91,6.3)
  Top Layer w0.4: v1(56.16,8.35) 56.63,7.88 H2.1 ; J1.1 34.23,10.82 34.23,10.42 33.56,9.76 30.39,9.76 29.58,10.57 v1(29.58,10.62) ; H2.17 35.19,7.42 v1(35.08,7.42)
  Bottom Layer w0.3: v2(27.2,17.62) 27.2,18.57 26.35,19.42 v2(26.35,26.52) ; v1(56.16,8.35) 54.11,6.3 v1(37.91,6.3) ; U4.3 23.8,30.07 v1(22.7,31.17)
  Bottom Layer w0.4: v1(35.08,7.42) 34.08,8.42 31.08,8.42 29.58,9.92 v1(29.58,10.62)
4.2V: length 27.7
  Top Layer w0.4: J1.3 31.55,10.94 v1(31.55,13.77)
  Bottom Layer w0.4: C25.2 U4.9 ; C25.2 30.15,30.92 R13.1 ; C25.2 30.91,29.57 ; 30.91,29.57 31.15,29.33 31.15,22.89 29.35,21.09 29.35,15.97 v1(31.55,13.77) ; 30.91,29.57 C24.2
GND: length 23.9
  Top Layer w0.2: 58.65,13.67 57.45,13.67 ; 58.65,13.67 59.85,13.67 ; 58.65,13.67 58.65,14.17 ; 57.45,13.67 CN2.16 ; 57.45,13.67 56.25,13.67 ; v2(32.5,26.42) 32.85,26.42 R2.1 ; 53.65,13.96 53.94,13.67 55.05,13.67 ; 56.25,13.67 55.05,13.67 ; 56.25,13.67 CN2.10 ; 55.05,13.67 55.05,14.17 ; 59.85,13.67 61.05,13.67 61.05,14.17 ; 59.85,13.67 CN2.28
  Top Layer w0.3: C8.1 39.5,22.12 v2(38.5,22.12)
  Top Layer w0.4: 38.8,13.27 v2(38.8,12.22) ; C5.1 C11.1 C12.1 C13.1
  Bottom Layer w0.3: U4.7 28.06,30.57 28.31,30.83 28.31,30.85 28.38,30.92 v1(28.38,31.72) ; U6.7 44.21,30.57 44.46,30.83 44.46,30.85 44.58,30.97 v1(44.58,31.77)
  vias: v1(9.68,1.67) v1(14.68,0.72) v1(17.08,2.22) v1(17.28,0.67) v1(19.76,0.7) v1(20.18,10.72) v1(22.28,11.42) v1(22.34,0.7) v1(24.83,6.3) v1(25.93,17.27) v1(26.48,15.52) v1(26.48,13.81) v1(27.5,6.3) v1(32.23,16.72) v1(32.5,0.7) v1(34.63,13.67) v1(35.13,0.72) v1(37.58,0.96) v1(37.68,31.27) v1(37.63,4.87) v1(40.18,3.07) v1(40.12,0.7) v1(42.68,0.72) v1(45.25,4.87) v1(46.08,31.97) v1(47.74,4.87) v1(47.83,7.22) v1(50.28,2.24) v1(50.28,0.71) v1(51.73,8.72) v1(52.23,13.97) v1(52.23,12.12) v1(52.87,2.23) v1(54.93,8.62) v1(55.36,5.19) v1(55.33,1.82) v1(63.23,15.82) v1(63.25,10.66) v2(27.25,19.92) v2(30.25,18.82) v2(34.15,21.67) v2(34.15,20.92) v2(34.15,20.17) v2(34.9,21.67) v2(34.9,20.92) v2(34.9,20.17) v2(35.65,21.67) v2(35.65,20.92) v2(35.65,20.17) v2(39.65,27.92) v2(41.25,27.42) v2(43.1,20.57)
VIN: length 18.8
  Top Layer w0.6: H2.2 56.61,0.72 v1(55.38,0.72) ; v1(52.88,0.67) 54.06,0.67 H2.4
  Bottom Layer w0.35: U6.2 C32.2 C33.2 v2(36.3,31.42) ; 18.9,24.92 18.9,28.92 19.55,29.57 C22.2 C23.2 U4.2
  vias: v2(18.9,24.92)
CKN: length 64.5
  Top Layer w0.2: CN2.20 58.25,14.53 58.23,14.55 58.23,15.62 54.43,19.42 54.43,44.52 50.1,48.85 24.45,48.85 24.38,48.92 23.72,48.92
CKP: length 64.5
  Top Layer w0.2: 23.72,48.42 24.38,48.42 24.45,48.49 27.68,48.49 27.82,48.35 27.82,48.16 27.96,48.02 29.2,48.02 29.34,48.16 29.34,48.35 29.48,48.49 49.95,48.49 54.08,44.37 54.08,19.27 57.88,15.48 57.88,14.55 57.85,14.53 CN2.18
D0N: length 68.4
  Top Layer w0.2: CN2.26 59.45,14.53 59.43,14.55 59.43,15.92 55.43,19.92 55.43,47.22 50.8,51.85 24.45,51.85 24.38,51.92 23.72,51.92
D0P: length 68.4
  Top Layer w0.2: 23.72,51.42 24.38,51.42 24.45,51.49 27.66,51.49 27.8,51.35 27.8,51.16 27.94,51.02 29.19,51.02 29.33,51.16 29.33,51.35 29.47,51.49 50.65,51.49 55.08,47.07 55.08,19.77 59.08,15.77 59.08,14.55 59.05,14.53 59.05,14.17
D1N: length 62.9
  Top Layer w0.2: v1(24.93,50.67) 24.68,50.42 23.72,50.42 ; 57.05,14.17 57.05,14.53 57.03,14.55 57.03,14.86 53.08,18.8 53.08,42.12 48.03,47.17 48.03,47.52 v1(48.08,47.57)
  Bottom Layer w0.2: v1(24.93,50.67) 25.23,50.37 44.88,50.37 47.35,47.9 47.75,47.9 v1(48.08,47.57)
D1P: length 62.9
  Top Layer w0.2: v1(24.93,49.72) 24.73,49.92 23.72,49.92 ; v1(47.38,46.97) 47.73,46.97 52.73,41.97 52.73,18.66 56.68,14.71 56.68,14.55 56.65,14.53 56.65,14.17
  Bottom Layer w0.2: v1(47.38,46.97) 47.05,47.3 47.05,47.7 44.73,50.02 29.43,50.02 29.28,49.88 29.28,49.66 29.14,49.52 27.9,49.52 27.76,49.66 27.76,49.88 27.62,50.02 25.23,50.02 v1(24.93,49.72)
D2N: length 58.2
  Top Layer w0.2: CN2.8 55.85,14.53 55.83,14.55 55.83,14.86 51.78,18.9 51.78,39.17 43.6,47.35 24.45,47.35 24.38,47.42 23.72,47.42
D2P: length 58.1
  Top Layer w0.2: CN2.6 55.45,14.53 55.48,14.55 55.48,14.71 51.43,18.75 51.43,39.02 43.46,46.99 29.49,46.99 29.34,46.85 29.34,46.71 29.2,46.57 27.96,46.57 27.82,46.71 27.82,46.85 27.68,46.99 24.45,46.99 24.38,46.92 23.72,46.92
D3N: length 66.5
  Top Layer w0.2: v1(56.13,46.07) 57.18,45.02 57.18,19.82 59.37,17.62 59.37,17.51 59.67,17.22 59.78,17.22 60.63,16.37 60.63,14.75 60.65,14.73 60.65,14.17 ; 23.72,45.92 24.7,45.92 24.83,46.05 v1(24.98,46.05)
  Bottom Layer w0.2: v1(24.98,46.05) 25.6,46.05 25.78,45.87 55.47,45.87 55.67,46.07 v1(56.13,46.07)
D3P: length 66.5
  Top Layer w0.2: CN2.30 60.25,14.53 60.28,14.55 60.28,16.02 56.83,19.47 56.83,44.62 v1(56.13,45.32) ; 23.72,45.42 24.71,45.42 24.83,45.29 v1(24.98,45.29)
  Bottom Layer w0.2: v1(56.13,45.32) 55.47,45.32 55.27,45.52 29.42,45.52 29.28,45.38 29.28,45.01 29.14,44.87 27.9,44.87 27.75,45.01 27.75,45.38 27.61,45.52 25.77,45.52 25.55,45.29 v1(24.98,45.29)
ELVDD: length 57
  Top Layer w0.2: 61.85,10.97 62.25,10.97 CN2.39 ; 61.85,10.97 61.45,10.97 CN2.35 ; 61.85,10.97 CN2.37 ; 42.3,16.32 40.88,17.75 40.69,17.75 ; 33.45,27.39 C9.2 33.45,27.39 ; 33.45,27.39 33.49,27.35 33.45,27.39
  Top Layer w0.3: U1.23 v2(34.15,24.37) 33.77,24.76 30.9,24.76 30.9,26.72 31.53,27.35 33.49,27.35
  Top Layer w0.4: v1(61.85,9.97) 61.85,10.97 ; v2(42.3,17.97) C16.2 C15.2 C14.2 C4.2 v2(50.9,16.32)
  Bottom Layer w0.3: v1(61.85,9.97) 61.83,9.99 61.83,12.57 58.08,16.32 v2(50.9,16.32)
  Bottom Layer w0.4: 42.3,17.97 38.3,17.97 36.75,19.52 36.75,21.77 v2(34.15,24.37)
ELVSS: length 51.6
  Top Layer w0.2: 61.85,14.97 61.45,14.97 CN2.36 ; 61.85,14.97 CN2.38 ; 61.85,14.97 62.25,14.97 62.25,14.17 ; 42.79,23.62 42.79,23.66 ; 36.95,20.62 36.9,20.67
  Top Layer w0.4: C11.2 C5.2 ; C11.2 C12.2 ; C11.2 44.5,23.92 R6.1 42.8,23.67 R3.1 ; v1(61.85,15.87) 61.85,14.97 ; C12.2 46.7,20.97 44.55,18.82 D2.2 41.19,19.98 40.5,20.67 36.9,20.67 ; C12.2 C13.2 v2(50.75,25.42)
  Bottom Layer w0.3: v1(61.85,15.87) 59.83,15.87 58.08,17.62 58.08,24.02 56.68,25.42 v2(50.75,25.42)
PANEL_1.8V: length 56.3
  Top Layer w0.2: 19.12,17.82 U2.1 19.12,17.82 ; 19.12,17.82 18.48,17.82 ; 19.12,17.82 18.48,17.82 ; v1(20.6,11.52) 18.75,13.37 18.75,17.55 18.48,17.82 ; v2(58.9,12.72) 59.2,12.72 59.85,12.07 CN2.27 ; v2(56.05,12.72) 56.25,12.52 CN2.9 ; 18.48,17.82 17.6,17.82 18.48,17.82
  Bottom Layer w0.2: 58.38,12.72 v2(56.05,12.72) ; 58.38,12.72 58.38,12.11 57.88,11.61 26.13,11.61 24.45,9.92 21.75,9.92 20.6,11.07 v1(20.6,11.52) ; 58.38,12.72 v2(58.9,12.72)
PANEL_1.8V_EN: length 17.5
  Top Layer w0.2: H2.32 17.73,1.5 17.73,7.42 21.28,10.97 R20.1
  Top Layer w0.3: R20.1 21.33,15.02 21.33,16.37
PANEL_3.3V: length 49.3
  Top Layer w0.2: v1(36.05,12.87) 37.65,11.27 39.85,11.27 41.85,13.27 ; 60.65,11.77 60.65,12.87 60.25,13.27 56.25,13.27 ; v1(41.25,12.87) 41.65,13.27 41.85,13.27 ; 41.85,13.27 56.25,13.27 ; 56.25,13.27 56.65,12.87 56.65,11.77 ; v1(23.85,12.87) U7.6 U7.5
  Bottom Layer w0.2: v1(23.85,12.87) 24.05,12.67 33.05,12.67 33.25,12.87 v1(36.05,12.87) v1(41.25,12.87)
PANEL_3.3V_EN: length 16.1
  Top Layer w0.2: R17.1 U7.3 26.43,14.77 26.98,14.22 26.98,12.95 26.33,12.3 24.53,12.3 H2.31
PANEL_EN: length 49.8
  Top Layer w0.2: v1(57.67,11.1) 57.85,11.28 CN2.17 CN2.19 ; v1(16.98,3.9) 16.65,3.9 H2.36
  Bottom Layer w0.2: v1(57.67,11.1) 56.78,11.1 56.58,11.3 26.25,11.3 18.85,3.9 v1(16.98,3.9)
PANEL_ERR_FG: length 34
  Top Layer w0.2: v1(56.16,9.97) 56.24,10.05 57.84,10.05 59.05,11.26 59.05,11.77 ; v1(44.5,10.17) 41.83,7.5 40.76,7.5 40.63,7.37 40.63,5.5 39.03,3.9 34.43,3.9 H2.22
  Bottom Layer w0.2: v1(44.5,10.17) 44.71,9.97 v1(56.16,9.97)
PANEL_PCD: length 28.5
  Top Layer w0.2: 57.05,11.77 57.05,11.37 56.4,10.72 v1(56.18,10.72) ; H2.18 39.51,3.9 49.31,3.9 50.71,5.3 50.71,10.25 v1(51.18,10.72)
  Bottom Layer w0.2: v1(51.18,10.72) v1(56.18,10.72)
PANEL_RESET: length 54.4
  Top Layer w0.2: 10.91,6.3 v1(11.91,6.3) ; CN2.25 59.45,11.04 57.66,9.25 v1(56.16,9.25)
  Bottom Layer w0.2: v1(56.16,9.25) 55.74,9.67 39.93,9.67 33.2,2.94 16.52,2.94 15.65,3.81 15.65,3.81 15.23,4.23 15.23,4.23 13.16,6.3 v1(11.91,6.3)
PANEL_TE: length 25.8
  Top Layer w0.2: 58.65,11.77 58.58,11.7 58.58,11.3 57.83,10.55 v1(57.08,10.55) ; 52.98,5.1 51.38,3.5 41.65,3.5 H2.16
  Bottom Layer w0.2: v1(52.98,5.3) 53.62,5.3 53.8,5.48 54.11,5.48 56.73,8.1 56.73,10.2 v1(57.08,10.55)
TPS65131_EN: length 30.3
  Top Layer w0.2: 34.05,17.67 34.15,17.77 34.15,18.1 34.14,18.11 34.14,18.53 34.15,18.54 U1.8 ; 34.05,17.67 33.73,17.35 33.73,16.2 33.65,16.13 33.65,16.07 33.05,15.47 33.05,15.15 33.15,15.05 ; 34.05,17.67 34.77,17.67 35.2,18.1 35.2,18.87 35.18,18.89 ; v1(19.55,11.5) 19.55,9.86 H2.33 ; 33.15,15.05 33.15,12.45 v1(33.35,12.25) ; 33.15,15.05 R18.1 ; 35.18,18.89 U1.10 35.18,18.89
  Bottom Layer w0.2: v1(33.35,12.25) 20.3,12.25 v1(19.55,11.5)
TPS65131_VSRC: length 21.3
  Top Layer w0.4: v1(30.04,20.62) 30.04,21.17 29.78,21.42 26.2,21.42 Q1.2 ; v1(30.04,20.62) C2.2 ; v1(30.04,20.62) 30.64,20.62 R7.1 ; 32.9,20.17 32.9,19.67 32.45,19.22 v1(31.43,19.22) ; J1.2 32.83,11.89 32.64,12.08 v1(32.64,13.62)
  Bottom Layer w0.4: v1(32.64,13.62) 31.43,14.82 v1(31.43,19.22) v1(30.04,20.62)
TSP_ATTN: length 13
  Top Layer w0.2: H2.11 48.93,11.3 54.18,11.3 54.65,11.77
TSP_RESET: length 17.6
  Top Layer w0.2: CN2.7 55.85,11.97 55.12,12.7 47.79,12.7 H2.13
TSP_SCL: length 7.7
  Top Layer w0.2: H2.5 51.55,7.44 52.36,8.25 53.46,8.25 55.43,10.21 55.43,11.39 55.45,11.41 CN2.5
TSP_SDA: length 7.7
  Top Layer w0.2: v1(53.26,8.75) 53.57,9.07 53.57,9.27 53.24,9.6 53.24,9.8 54.12,10.68 54.32,10.68 54.65,10.34 54.85,10.34 55.05,10.55 55.05,11.77 ; H2.3 54.09,7.71 v1(54.08,7.72)
  Bottom Layer w0.2: v1(53.26,8.75) 54.08,7.93 v1(54.08,7.72)
VLIN1: length 48.2
  Top Layer w0.3: CN2.29 60.25,9.5 61.43,8.32 62.83,8.32 64.28,9.77 64.28,16.17 63.63,16.82 60.78,16.82 v1(59.88,17.72)
  Bottom Layer w0.3: C31.2 57.23,29.57 58.88,27.92 58.88,18.72 v1(59.88,17.72)
  Bottom Layer w0.35: 47.3,32.17 46.3,31.17 C30.2 ; 43.8,29.57 C30.2 ; C30.2 C31.2
VLIN1_EN: length 54.3
  Top Layer w0.2: 35.41,15.94 35.43,15.92 35.43,10.59 35.41,10.57 ; 35.41,15.94 35.41,10.57 ; 35.41,15.94 R19.1 35.85,16.72 v2(36.5,17.37) ; 35.41,10.57 34.2,9.36 24.13,9.36 H2.29
  Bottom Layer w0.2: v2(36.5,17.37) 36.5,18.12 35.7,18.92 34.05,18.92 33.45,19.52 33.45,24.72 34.4,25.67 34.4,31.32 35.2,32.12 37.85,32.12 39.9,30.07 U6.3
$1N52: length 7.9
  Top Layer w0.2: 38.8,16.27 38.82,16.29 38.82,18.82
  Top Layer w0.4: 38.8,16.27 38.82,18.65 38.82,18.82 37.75,18.82 36.9,19.67 36.9,20.17
$1N56: length 6.9
  Top Layer w0.3: 32.9,22.17 31.12,22.17 D1.2 29.54,22.39 L1.2
  Top Layer w0.4: 32.9,22.17 U1.24
$1N59: length 4.5
  Top Layer w0.3: 36.9,22.16 39.7,24.96 C7.1
$1N60: length 4.8
  Top Layer w0.2: 35.15,23.23 U1.21 35.15,23.23 ; 35.15,23.23 35.15,23.67 35.8,24.32 37.1,24.32 37.7,24.92 C6.1
$1N63: length 9.6
  Top Layer w0.2: C1.2 24.2,24.07 L1.1 ; 22.6,18.87 Q1.3
  Top Layer w0.4: L1.1 23.25,22.47 C1.2 22.6,22.33 22.55,22.28 Q1.3
$1N65: length 19.2
  Top Layer w0.2: 33,18.27 24.95,18.27 Q1.1 24.9,18.22 33.15,18.22 33.65,18.72 U1.7 33,18.27
$1N66: length 9.7
  Top Layer w0.2: 39.5,23.22 40.69,23.22 R4.2 ; 37.2,21.67 38.76,23.22 39.5,23.22 38.85,23.22 37.3,21.67 37.2,21.67 ; 37.2,21.67 36.9,21.67 ; 36.9,21.67 37.2,21.67
  Top Layer w0.4: R4.2 39.81,23.52 39.5,23.22
$1N67: length 8
  Top Layer w0.2: 36.9,21.17 40.15,21.17 R4.1
  Top Layer w0.4: R4.1 R3.2 44.31,22.02 C10.2
$1N68: length 10.2
  Top Layer w0.2: R5.1 35,28.87 ; 35,28.87 R1.1 ; 35,28.87 R1.1 ; 34.65,23.72 U1.22 34.65,23.72 ; 34.65,23.72 35.01,24.07 R2.2 ; R1.1 R2.2 ; R2.2 35.01,27.34
$1N73: length 1.9
  Top Layer w0.4: R6.2 45.55,23.46 C10.1
$1N74: length 3.4
  Top Layer w0.2: R5.2 33.51,30.52 C9.1 35.1,30.47 R5.2
$1N95: length 15.3
  Top Layer w0.2: R7.2 29.71,19.64 ; R7.2 29.71,19.64 ; R7.2 31.78,20.67 v2(32,20.67) 32.9,20.67 32,20.67 ; 29.71,19.64 C3.2 29.71,19.64 ; v2(35.65,17.72) U1.11 ; U1.9 v2(34.65,18.32)
  Bottom Layer w0.2: 34.3,17.72 v2(35.65,17.72) ; 34.3,17.72 34.65,18.07 v2(34.65,18.32) ; 34.3,17.72 32.9,17.72 32,18.62 v2(32,20.67)
$1N117: length 3.4
  Bottom Layer w0.4: U4.10 28,28.72 L3.2
$1N118: length 3.4
  Bottom Layer w0.4: U4.1 24.3,28.72 L3.1
$1N123: length 2
  Bottom Layer w0.35: C26.2 27.63,32.65 U4.6
$1N127: length 8
  Bottom Layer w0.35: R14.2 32.66,33.42 R13.2 30.7,32.98 C27.2 29.15,30.92 28.3,30.07 U4.8
$1N132: length 8.1
  Bottom Layer w0.35: U6.8 44.45,30.07 45.3,30.92 45.3,32.98 46.6,32.98 47.3,33.67 48.8,33.67 R16.2
$1N137: length 2
  Bottom Layer w0.35: C29.2 43.78,32.65 U6.6
$1N140: length 3.4
  Bottom Layer w0.4: U6.1 40.45,28.72 L4.1
$1N141: length 3.4
  Bottom Layer w0.4: 43.8,29.07 44.15,28.72 L4.2
$1N6505: length 1.6
  Top Layer w0.3: U7.4 22.89,14.78 C34.1

## Copper pours and planes (outline as drawn; the poured copper is in the pictures)
GND on Top Layer: -26.67,68.97 78.33,68.97 78.33,-11.13 -26.67,-11.13
GND on Bottom Layer: -2.32,60.62 68.33,60.62 68.33,-7.98 -2.32,-7.98
GND on Bottom Layer: 33.8,22.02 36,22.02 36,19.82 33.8,19.82
GND on GND: 0.1,55.9 64.9,55.9 64.9,0.1 0.1,0.1
GND on GND: 2,8.26 5,8.26 5,4.99 2,4.99
GND on GND: 60,8.26 63,8.26 63,4.99 60,4.99
GND on GND: 60,51.01 63,51.01 63,47.74 60,47.74
GND on GND: 2,51.01 5,51.01 5,47.74 2,47.74
GND on GND: 56.74,54 60.01,54 60.01,51 56.74,51
VIN on VIN: 0.1,55.9 64.9,55.9 64.9,0.1 0.1,0.1

Small or netless copper shapes (teardrops, artwork), in the pictures only: 18 on GND
